# EAGLE schematic clip_LMT84 (EAGLE 7.6.0)
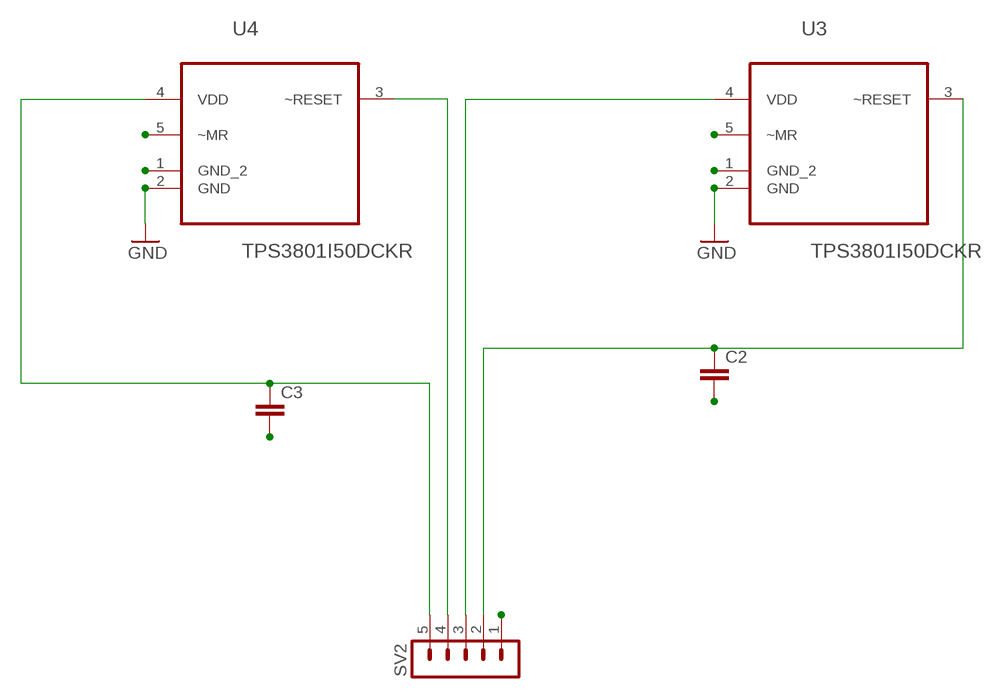
[diagram p0: schematic, sheet 1]

## Parts
C2  CAP0402-CAP  [0402-CAP]
C3  CAP0402-CAP  [0402-CAP]
SV2  MA05-1  [MA05-1]
U3  TPS3801I50DCKR  [SOT65P210X110-5N]
U4  TPS3801I50DCKR  [SOT65P210X110-5N]

## Nets
GND: C2.2 C3.2 SV2.1 U3.1(GND_2) U3.2(GND) U3.5(~MR) U4.1(GND_2) U4.2(GND) U4.5(~MR)
N$1: SV2.3 U3.4(VDD)
N$2: C3.1 SV2.5 U4.4(VDD)
N$3: SV2.4 U4.3(~RESET)
VOUT_AIR: C2.1 SV2.2 U3.3(~RESET)

## Library data of the parts
C2 C3 = SparkFun:CAP: Capacitor Standard 0603 ceramic capacitor, and 0.1" leaded capacitor.
SV2 = con-lstb:MA05-1: PIN HEADER; OC_FARNELL: unknown; OC_NEWARK: unknown
U3 U4 = Texas Instruments_By_element14_Batch_1:TPS3801I50DCKR: VOLTAGE SUPERVISORS; MPN: TPS3801I50DCKR; OC_FARNELL: 1652466; OC_NEWARK: 77C0385; PACKAGE: SC-70-5; SUPPLIER: Texas Instruments